# Altium schematic sheet Sheet6_Power_Path.SchDoc
size A4; SheetNumber: 6; SheetTotal: 6
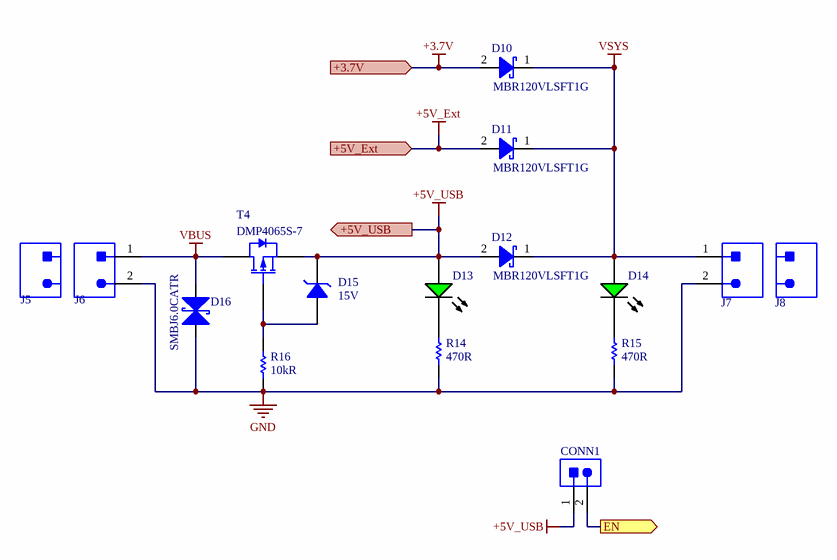
[diagram p0: Sheet6_Power_Path.SchDoc]

## Parts
?  (no value)  (graphical)
CONN1  TSW-101-07-G-D  [HDR2X1]  (value not drawn)
D10  MBR120VLSFT1G  [SOD-123F]
D11  MBR120VLSFT1G  [SOD-123F]
D12  MBR120VLSFT1G  [SOD-123F]
D13  LTST-C170GKT  [0805-LED-G]  (value not drawn)
D14  LTST-C170GKT  [0805-LED-G]  (value not drawn)
D15  Zener Voltage: 15V  [SOD-123]  (hidden comment: MMSZ5245B-TP)
D16  SMBJ6.0CATR  [DO-214AA]
J5  5447861  [5447861]  (value not drawn)
J6  5444262  [5444262]  (value not drawn)
J7  5444262  [5444262]  (value not drawn)
J8  5447861  [5447861]  (value not drawn)
R14  value 470R  [R-0805]  (hidden comment: CRGCQ0805J470R)
R15  value 470R  [R-0805]  (hidden comment: CRGCQ0805J470R)
R16  value 10kR  [R-0805]  (hidden comment: RC0805FR-0710KL)
T4  DMP4065S-7  [SOT23-3]

## Ports
+3.7V (in, see Sheet2_Hierarquia[3B], Sheet5_Proteção_Bateria[1B]), +5V_Ext (in, see Sheet2_Hierarquia[2C], Sheet3_Buck[4A], Sheet4_Carregador_Bateria[1A]), +5V_USB (out, see Sheet2_Hierarquia[2B], Sheet4_Carregador_Bateria[1B]), EN (out, see Sheet2_Hierarquia[2C], Sheet3_Buck[2B])

## Nets
+3.7V: D10.2(A) ; port +3.7V
+5V_Ext: D11.2(A) ; port +5V_Ext
+5V_USB: CONN1.1 D12.2(A) D13.2(A) D15.1(K) T4.2(S) ; port +5V_USB
GND: D16.2(Anode) J6.2 J7.2 R14.1 R15.1 R16.1
VBUS: D16.1(Cathode) J6.1 T4.3(D)
VSYS: D10.1(K) D11.1(K) D12.1(K) D14.2(A) J7.1
EN: CONN1.2 ; port EN
NetD13_1: D13.1(K) R14.2
NetD14_1: D14.1(K) R15.2
NetD15_2: D15.2(A) R16.2 T4.1(G)

## Notes on the sheet
- Título:
- Endereço:
- Rua Aprígio Veloso, 1500 - Bodocongó
  CEP: 58.429-140
  Campina Grande, Paraíba
  Brasil
- Projeto:
- Conta:
- Projetista:
- Arquivo:
- Data:
- Revisor:
- Pág.:
- Rev.:
- de

## Library data of the parts
? = Title Block
CONN1 = TSW-101-07-G-D: CONN HEADER VERT 2POS; Manufacturer: Samtec; Gender: Male; Number of Contacts: 2; Max Current Rating: 7.6A; Max Voltage Rating (AC): 550V; Supplier: Digikey; Supplier Part Number: SAM1028-01-ND; Manufacturer Part Number: TSW-101-07-G-D; RoHS: Yes; Category: Connectors; Stock: 2725; Pricing: 1=0,3, 10=0,251, 100=0,1954, 500=0,16752, 1000=0,1396, 5000=0,11965, 10000=0,11168 (USD); Mounting Technology: Through Hole; Contact Plating: Gold; Contact Material: Bronze; Contact Shape: Square; Contact Finish - Mating: GOLD; Insulation Material: PBT; Insulation Color: Black; Housing Color: Black; Housing Material: Polyester; Min Operating Temperature: -55°C; Max Operating Temperature: 125°C; Number of Rows: 2; Termination: Solder; Packaging: Bulk; Number of Positions: 2; Connector Type: Header; Series: TSW; Contact Type: Male Pin; Fastening Type: Pull; Orientation: Straight; Length: 2.54mm; Width: 5.08mm; Depth: 5.08mm; RoHS Compliant: Yes; Lead Free: Lead Free; Reach SVHC Compliant: No; Flammability Rating: UL94 V-0; ComponentLink1URL: https://datasheet.ciiva.com/6861/tsw-xxx-xx-xxx-x-xx-xxx-mkt-6861372.pdf?src-supplier=Digikey; ComponentLink1Description: https://datasheet.ciiva.com/6861/tsw-xxx-xx-xxx-x-xx-xxx-mkt-6861372.pdf?src-supplier=Digikey; ComponentLink2URL: https://datasheet.ciiva.com/48561/htsw-th-48561486.pdf?src-supplier=Avnet; ComponentLink2Description: https://datasheet.ciiva.com/48561/htsw-th-48561486.pdf?src-supplier=Avnet; Supplier 1: Digikey; Supplier Part Number 1: SAM1028-01-ND; Supplier 2: Mouser; Supplier Part Number 2: 200-TSW10107GD
D10-D12 = MBR120VLSFT1G: DIODE SCHOTTKY 20V 1A SOD123FL; Manufacturer: ON Semiconductor; Max Surge Current: 45A; Forward Voltage: 340mV; Max Reverse Current: 600uA; Element Configuration: Single; Polarity: Standard; Supplier: Digikey; Supplier Part Number: MBR120VLSFT1GOSCT-ND; Manufacturer Part Number: MBR120VLSFT1G; RoHS: Yes; Category: Schottky Diodes; Stock: 20847; Pricing: 1=0,56, 10=0,348, 100=0,2217, 500=0,16708, 1000=0,14944 (USD); Pins: 2; Min Operating Temperature: -65°C; Max Operating Temperature: 125°C; Package Quantity: 3000; Forward Current: 1A; Packaging: Tape and Reel; Max Reverse Leakage Current: 600uA; Average Rectified Current: 1A; Max Repetitive Reverse Voltage (Vrrm): 20V; Max Forward Surge Current (Ifsm): 45A; Peak Non-Repetitive Surge Current: 45A; Voltage Rating (DC): 20V; Current Rating: 1A; Output Current: 1A; Max Reverse Voltage (DC): 20V; Series: -; Length: 0.114inch; Width: 0.071inch; Height: 0.035inch; Radiation Hardening: No; Reach SVHC Compliant: No; Lead Free: Lead Free; Halogen Free: Halogen Free; RoHS Compliant: Yes; ComponentLink1URL: https://datasheet.ciiva.com/7962/85900-7962720.pdf?src-supplier=Element14; ComponentLink1Description: https://datasheet.ciiva.com/7962/85900-7962720.pdf?src-supplier=Element14; ComponentLink2URL: https://datasheet.ciiva.com/915/mbr120vlsft1-d-915659.pdf?src-supplier=Digikey; ComponentLink2Description: https://datasheet.ciiva.com/915/mbr120vlsft1-d-915659.pdf?src-supplier=Digikey; ComponentLink3URL: https://datasheet.ciiva.com/915/mbr120vlsft1-d-915660.pdf?src-supplier=Digikey; ComponentLink3Description: https://datasheet.ciiva.com/915/mbr120vlsft1-d-915660.pdf?src-supplier=Digikey; ComponentLink4URL: https://datasheet.ciiva.com/18435/70100467-18435526.pdf?src-supplier=Allied+Electronics; ComponentLink4Description: https://datasheet.ciiva.com/18435/70100467-18435526.pdf?src-supplier=Allied+Electronics; ComponentLink5URL: https://datasheet.ciiva.com/16392/mbr120vlsft1-d-16392906.pdf?src-supplier=Future+Electronics; ComponentLink5Description: https://datasheet.ciiva.com/16392/mbr120vlsft1-d-16392906.pdf?src-supplier=Future+Electronics; Supplier 1: Digikey; Supplier Part Number 1: MBR120VLSFT1GOSCT-ND; Supplier 2: Mouser; Supplier Part Number 2: 863-MBR120VLSFT1G
D13 D14 = LTST-C170GKT: LED GREEN CLEAR SMD; Manufacturer: Vishay Lite-On; Lens Color: Colorless; Luminous Intensity: 6mcd; Forward Voltage: 2.1V; Test Current: 10mA; Wavelength: 565nm; Viewing Angle: 130°; Dominant Wavelength: 569nm; Lens Style: Diffused,Colorless,Rectangular; Forward Current: 30mA; Number of LEDs: 1; Power Dissipation: 100mW; Reverse Voltage: 5V; Supplier 1: Digi-Key; Manufacturer Part Number: LTST-C170GKT; RoHS: Yes; Category: LEDs; Stock 1: 753504; Pricing 1: 1=0,30000, 10=0,16000, 100=0,07440, 500=0,06870, 1000=0,05382 (USD); Mount: Surface Mount; Case/Package: 0805; Number of Pins: 2; Color: Green; Case Code (Metric): 2012; Case Code (Imperial): 0805; Min Operating Temperature: -55°C; Max Operating Temperature: 85°C; Package Quantity: 1; Packaging: Tape and Reel; Series: CHIPLED 0805; Lens Transparency: Clear; Illumination Color: Green; Number of Elements: 1; Power Rating: 100mW; Voltage: 5V; Length: 2mm; Width: 1.25mm; Height: 1.1mm; Depth: 1.25mm; Radiation Hardening: No; RoHS Compliant: Yes; Lead Free: Lead Free; ComponentLink1URL: https://datasheet.ciiva.com/2110/ltst-c170gkt-2110128.pdf?src-supplier=Digi-Key; ComponentLink1Description: https://datasheet.ciiva.com/2110/ltst-c170gkt-2110128.pdf?src-supplier=Digi-Key; ComponentLink2URL: https://datasheet.ciiva.com/11773/0900766b80dc0278-11773630.pdf?src-supplier=RSComponents; ComponentLink2Description: https://datasheet.ciiva.com/11773/0900766b80dc0278-11773630.pdf?src-supplier=RSComponents; ComponentLink3URL: https://datasheet.ciiva.com/12400/lite-on-ltst-c170gkt-187191-12400783.pdf?src-supplier=Mouser; ComponentLink3Description: https://datasheet.ciiva.com/12400/lite-on-ltst-c170gkt-187191-12400783.pdf?src-supplier=Mouser; ComponentLink4URL: https://datasheet.ciiva.com/15117/getdatasheetpartid-142079-15117738.pdf?src-supplier=Verical; ComponentLink4Description: https://datasheet.ciiva.com/15117/getdatasheetpartid-142079-15117738.pdf?src-supplier=Verical; ComponentLink5URL: https://datasheet.ciiva.com/25772/ltst-c170gkt-25772881.pdf?src-supplier=Allied+Electronics; ComponentLink5Description: https://datasheet.ciiva.com/25772/ltst-c170gkt-25772881.pdf?src-supplier=Allied+Electronics; ComponentLink6URL: https://datasheet.ciiva.com/16387/ltst-c170gkt-16387357.pdf?src-supplier=Future+Electronics; ComponentLink6Description: https://datasheet.ciiva.com/16387/ltst-c170gkt-16387357.pdf?src-supplier=Future+Electronics; Supplier 2: Mouser; Supplier Part Number 2: 859-LTST-C170GKT; Supplier Part Number 1: 160-1179-1-ND; JLCPCB Part: C125090
D15 = MMSZ5245B-TP: DIODE ZENER 15V 500MW SOD123; Manufacturer: MCC; Tolerance: 5%; Impedance: 16R; Max Reverse Leakage Current: 100nA; Test Current: 8.5mA; Element Configuration: Single; Supplier 1: Digi-Key; Manufacturer Part Number: MMSZ5245B-TP; RoHS: Yes; Category: Zener Diodes; Stock 1: 330368; Pricing 1: 1=0,22000, 10=0,17700, 100=0,09400, 500=0,06188, 1000=0,04208 (USD); Mount: Surface Mount; Number of Pins: 2; Min Operating Temperature: -55°C; Max Operating Temperature: 150°C; Packaging: Tape and Reel; Package Quantity: 1; Max Power Dissipation: 500mW; Power Dissipation: 500mW; Voltage Tolerance: 5%; Series: -; Lead Free: Lead Free; ComponentLink1URL: https://datasheet.ciiva.com/890/mmsz5221-mmsz5259sod123-890445.pdf?src-supplier=Digi-Key; ComponentLink1Description: https://datasheet.ciiva.com/890/mmsz5221-mmsz5259sod123-890445.pdf?src-supplier=Digi-Key; ComponentLink2URL: https://datasheet.ciiva.com/890/mmsz5221-mmsz5259sod123-890446.pdf?src-supplier=Digi-Key; ComponentLink2Description: https://datasheet.ciiva.com/890/mmsz5221-mmsz5259sod123-890446.pdf?src-supplier=Digi-Key; ComponentLink3URL: https://datasheet.ciiva.com/890/mmsz5221-mmsz5259sod123-890447.pdf?src-supplier=Digi-Key; ComponentLink3Description: https://datasheet.ciiva.com/890/mmsz5221-mmsz5259sod123-890447.pdf?src-supplier=Digi-Key; Supplier 2: Mouser; Supplier 3: Arrow Electronics; Supplier Part Number 1: MMSZ5245B-TPMSCT-ND; Supplier Part Number 2: 833-MMSZ5245B-TP; Supplier Part Number 3: MMSZ5245B-TP
D16 = SMBJ6.0CA-TR: TVS DIODE 6VWM 10.3VC SMB; Manufacturer: STMicroelectronics; Reverse Standoff Voltage: 6V; Min Breakdown Voltage: 6.7V; Clamping Voltage: 13.7V; Peak Pulse Power: 600W; Peak Pulse Current: 290A; Number of Bidirectional Channels: 1; Power Line Protection: No; Test Current: 10mA; Direction: Bidirectional; Max Reverse Leakage Current: 20uA; Element Configuration: Single; Diode Type: ZENER; Capacitance: 3.85nF; Max Breakdown Voltage: 7.05V; Supplier 1: Digi-Key; Manufacturer Part Number: SMBJ6.0CA-TR; RoHS: Yes; Category: Diodes; Stock 1: 1863; Pricing 1: 1=0,44000, 10=0,35800, 100=0,24390, 500=0,18296, 1000=0,13721 (USD); Mount: Surface Mount; Case/Package: DO-214AA; Number of Pins: 2; Min Operating Temperature: -55°C; Max Operating Temperature: 150°C; Resistor Type: Zener; Packaging: Tape and Reel; Voltage Rating (DC): 6V; Series: SMBJ, TRANSIL™; Operating Supply Voltage: 6V; Reverse Breakdown Voltage: 6.7V; Package Quantity: 1; Max Surge Current: 10mA; Breakdown Voltage: 6.7V; Polarity: Bidirectional; Number of Elements: 1; Leakage Current: 20uA; Power Dissipation: 600W; Clamping Voltage-Max: 13.7V; Length: 4.6mm; Width: 3.95mm; Height: 2.45mm; Radiation Hardening: No; RoHS Compliant: Yes; Lead Free: Lead Free; REACH SVHC: No SVHC; ComponentLink1URL: https://datasheet.ciiva.com/15143/getdatasheetpartid-64868-15143186.pdf?src-supplier=Verical; ComponentLink1Description: https://datasheet.ciiva.com/15143/getdatasheetpartid-64868-15143186.pdf?src-supplier=Verical; ComponentLink2URL: https://datasheet.ciiva.com/7973/1761316-7973591.pdf?src-supplier=Element14; ComponentLink2Description: https://datasheet.ciiva.com/7973/1761316-7973591.pdf?src-supplier=Element14; ComponentLink3URL: https://datasheet.ciiva.com/337/cd00001366-337980.pdf?src-supplier=Digi-Key; ComponentLink3Description: https://datasheet.ciiva.com/337/cd00001366-337980.pdf?src-supplier=Digi-Key; ComponentLink4URL: https://datasheet.ciiva.com/337/cd00001366-337979.pdf?src-supplier=Digi-Key; ComponentLink4Description: https://datasheet.ciiva.com/337/cd00001366-337979.pdf?src-supplier=Digi-Key; ComponentLink5URL: https://datasheet.ciiva.com/337/cd00001366-337981.pdf?src-supplier=Digi-Key; ComponentLink5Description: https://datasheet.ciiva.com/337/cd00001366-337981.pdf?src-supplier=Digi-Key; ComponentLink6URL: https://datasheet.ciiva.com/7973/1761316-7973594.pdf?src-supplier=Element14; ComponentLink6Description: https://datasheet.ciiva.com/7973/1761316-7973594.pdf?src-supplier=Element14; ComponentLink7URL: https://datasheet.ciiva.com/41443/001184246-da-01-en-transil-600w-6-smbj6-0ca-tr-do-214aa-stm-41443708.pdf?src-supplier=Conrad; ComponentLink7Description: https://datasheet.ciiva.com/41443/001184246-da-01-en-transil-600w-6-smbj6-0ca-tr-do-214aa-stm-41443708.pdf?src-supplier=Conrad; Supplier 2: Mouser; Supplier 3: Arrow Electronics; Supplier Part Number 3: SMBJ6.0CA-TR; Supplier Part Number 2: 511-SMBJ6.0CA-TR; Supplier Part Number 1: 497-7454-1-ND
J5 J8 = 5447861: TERM BLOCK PLUG 2POS STR 3.81MM; Manufacturer: Phoenix Contact; Current Rating: 8A; Voltage Rating: 160V; Number of Positions: 2; Number of Levels: 1; Connector Type: Screw; Voltage: 300V; Wire Gauge (Max): 30AWG; Wire Gauge (Min): 14AWG; Pitch: 0.15inch; Supplier 1: Digi-Key; Manufacturer Part Number: 5447861; RoHS: Yes; Category: Terminal Blocks; Stock 1: 30203; Pricing 1: 1=2,56000, 10=2,45300, 50=2,38620, 100=2,23000, 250=2,05160, 500=1,89550, 1000=1,80631, 2500=1,77954 (USD); Mount: Free Hanging; Number of Pins: 2; Color: Green; Contact Plating: Tin; Housing Material: Polyamide; Package Quantity: 100; Packaging: Bulk; Number of Positions Per Level: 2; Termination: Screw; Current: 8A; Flammability Rating: UL94 V-0; ComponentLink1URL: https://datasheet.ciiva.com/29706/5447861-29706032.pdf?src-supplier=Digi-Key; ComponentLink1Description: https://datasheet.ciiva.com/29706/5447861-29706032.pdf?src-supplier=Digi-Key; Supplier 2: Mouser; Supplier Part Number 1: 277-11343-ND; Supplier Part Number 2: 651-5447861; JLCPCB Part: *
J6 J7 = 5444262: TERM BLOCK HDR 2POS 90DEG 3.81MM; Manufacturer: Phoenix Contact; Current Rating: 8A; Voltage Rating: 160V; Number of Positions: 2; Number of Levels: 1; Voltage: 300V; Pitch: 0.15inch; Supplier 1: Digi-Key; Manufacturer Part Number: 5444262; RoHS: Yes; Category: Terminal Blocks; Stock 1: 66186; Pricing 1: 1=0,87000, 10=0,83600, 50=0,81320, 100=0,76000, 250=0,69920, 500=0,64600, 1000=0,61560, 2500=0,60648 (USD); Mount: Through Hole; Contact Plating: Tin; Color: Green; Housing Material: Polyamide; Packaging: Bulk; Termination: Solder; Package Quantity: 100; Number of Positions Per Level: 2; Current: 8A; Length: 9.2mm; RoHS Compliant: Yes; Flammability Rating: UL94 V-0; ComponentLink1URL: https://datasheet.ciiva.com/29682/5444262-29682658.pdf?src-supplier=Digi-Key; ComponentLink1Description: https://datasheet.ciiva.com/29682/5444262-29682658.pdf?src-supplier=Digi-Key; Supplier 2: Mouser; Supplier Part Number 2: 651-5444262; Supplier Part Number 1: 277-11313-ND; JLCPCB Part: *
R14 R15 = CRGCQ0805J470R: RES 470 OHM 5% 1/8W 0805; Manufacturer: TE Connectivity; Max Power Dissipation: 125mW; Temperature Coefficient: 100ppm/°C; Operating Supply Voltage: 150V; Supplier: Digikey; Supplier Part Number: A130132CT-ND; Manufacturer Part Number: CRGCQ0805J470R; RoHS: Yes; Category: Chip SMD Resistors; Stock: 837845; Pricing: 1=0,1, 10=0,026, 50=0,0162, 100=0,0137, 500=0,00942, 1000=0,00813 (USD); Case/Package: 0805; Case Code (Imperial): 0805; Case Code (Metric): 2012; Min Operating Temperature: -55°C; Max Operating Temperature: 155°C; Features: Moisture Resistant,Automotive AEC-Q200; Series: CRGCQ; Packaging: Cut Tape; Tolerance: 5%; Number of Terminations: 2; Power Rating: 125mW; Voltage Rating: 150V; Voltage Rating (DC): 150V; Height: 650um; Ratings: AEC-Q200; RoHS Compliant: Yes; ComponentLink1URL: http://datasheet.octopart.com/CRGCQ0805J470R-TE-Connectivity-datasheet-114679081.pdf?src-supplier=Digikey; ComponentLink1Description: http://datasheet.octopart.com/CRGCQ0805J470R-TE-Connectivity-datasheet-114679081.pdf?src-supplier=Digikey; ComponentLink2URL: http://datasheet.octopart.com/CRGCQ0805J470R-TE-Connectivity-datasheet-114679081.pdf?src-supplier=Farnell; ComponentLink2Description: http://datasheet.octopart.com/CRGCQ0805J470R-TE-Connectivity-datasheet-114679081.pdf?src-supplier=Farnell; ComponentLink3URL: http://datasheet.octopart.com/CRGCQ0805J470R-TE-Connectivity-datasheet-114679081.pdf?src-supplier=Avnet; ComponentLink3Description: http://datasheet.octopart.com/CRGCQ0805J470R-TE-Connectivity-datasheet-114679081.pdf?src-supplier=Avnet; ComponentLink4URL: http://datasheet.octopart.com/CRGCQ0805J470R-TE-Connectivity-datasheet-114679081.pdf?src-supplier=Mouser; ComponentLink4Description: http://datasheet.octopart.com/CRGCQ0805J470R-TE-Connectivity-datasheet-114679081.pdf?src-supplier=Mouser; ComponentLink5URL: http://datasheet.octopart.com/CRGCQ0805J470R-TE-Connectivity-datasheet-114679081.pdf?src-supplier=Newark; ComponentLink5Description: http://datasheet.octopart.com/CRGCQ0805J470R-TE-Connectivity-datasheet-114679081.pdf?src-supplier=Newark; ComponentLink6URL: http://datasheet.octopart.com/CRGCQ0805J470R-TE-Connectivity-datasheet-114679081.pdf?src-supplier=Onlinecomponents.com; ComponentLink6Description: http://datasheet.octopart.com/CRGCQ0805J470R-TE-Connectivity-datasheet-114679081.pdf?src-supplier=Onlinecomponents.com; ComponentLink7URL: https://datasheet.octopart.com/CRGCQ0805J470R-TE-Connectivity-datasheet-114679081.pdf?src-supplier=Master+Electronics; ComponentLink7Description: https://datasheet.octopart.com/CRGCQ0805J470R-TE-Connectivity-datasheet-114679081.pdf?src-supplier=Master+Electronics; ComponentLink8URL: http://datasheet.octopart.com/CRGCQ0805J470R-TE-Connectivity-datasheet-114679081.pdf?src-supplier=Heilind+Electronics; ComponentLink8Description: http://datasheet.octopart.com/CRGCQ0805J470R-TE-Connectivity-datasheet-114679081.pdf?src-supplier=Heilind+Electronics; ComponentLink9URL: http://datasheet.octopart.com/CRGCQ0805J470R-TE-Connectivity-datasheet-114679081.pdf?src-supplier=Sager+Electronics; ComponentLink9Description: http://datasheet.octopart.com/CRGCQ0805J470R-TE-Connectivity-datasheet-114679081.pdf?src-supplier=Sager+Electronics; ComponentLink10URL: http://datasheet.octopart.com/CRGCQ0805J470R-TE-Connectivity-datasheet-114679081.pdf?src-supplier=Interstate+Connecting+Components; ComponentLink10Description: http://datasheet.octopart.com/CRGCQ0805J470R-TE-Connectivity-datasheet-114679081.pdf?src-supplier=Interstate+Connecting+Components; ComponentLink11URL: http://datasheet.octopart.com/CRGCQ0805J470R-TE-Connectivity-datasheet-114679081.pdf?src-supplier=Electro+Sonic; ComponentLink11Description: http://datasheet.octopart.com/CRGCQ0805J470R-TE-Connectivity-datasheet-114679081.pdf?src-supplier=Electro+Sonic; Supplier 1: Mouser; Supplier Part Number 1: 279-CRGCQ0805J470R; Supplier 2: Digikey; Supplier Part Number 2: A130132CT-ND
R16 = RC0805FR-0710KL: RES 10K OHM 1% 1/8W 0805; Manufacturer: Yageo; Voltage Rating: 150V; Power Rating: 125mW; Temperature Coefficient: 100ppm/°C; Supplier: Digikey; Supplier Part Number: 311-10.0KCRCT-ND; Manufacturer Part Number: RC0805FR-0710KL; RoHS: Yes; Category: Chip SMD Resistors; Stock: 2107948; Pricing: 1=0,1, 10=0,027, 50=0,017, 100=0,0142, 500=0,00976, 1000=0,00844 (USD); Case/Package: 0805; Case Code (Imperial): 0805; Case Code (Metric): 2012; Min Operating Temperature: -55°C; Max Operating Temperature: 155°C; Packaging: Tape and Reel; Package Quantity: 1; Termination: SMD/SMT; Series: RC; Tolerance: 1%; Resistor Type: Thick Film; Number of Terminations: 2; Max Power Dissipation: 125mW; Features: Moisture Resistant; Construction: Rectangular; Resistance Tolerance: 1%; Technology: THICK FILM; Voltage Rating (AC): 150V; Length: 0.079inch; Width: 0.049inch; Height: 0.024inch; Depth: 1.25mm; RoHS Compliant: Yes; Reach SVHC Compliant: Unknown; Military Standard: Not; Lead Free: Lead Free; Supplier 1: Digikey; Supplier Part Number 1: 311-10.0KCRCT-ND; Supplier 2: Mouser; Supplier Part Number 2: 603-RC0805FR-0710KL; Supplier 3: Digikey; Supplier Part Number 3: 541-3976-1-ND
T4 = DMP4065S-7: MOSFET P-CH 40V 2.4A SOT23; Manufacturer: Diodes; Number of Channels: 1; Rds On Max: 80mR; Input Capacitance: 587pF; Max Power Dissipation: 720mW; Drain to Source Breakdown Voltage: -40V; Drain to Source Resistance: 64mR; Gate to Source Voltage (Vgs): 20V; Turn-Off Delay Time: 36.3ns; Turn-On Delay Time: 3.6ns; Supplier: Digikey; Supplier Part Number: DMP4065S-7DICT-ND; Manufacturer Part Number: DMP4065S-7; RoHS: Yes; Category: MOSFETs; Stock: 25010; Pricing: 1=0,43, 10=0,302, 100=0,1523, 500=0,135, 1000=0,10506 (USD); Mounting Technology: Surface Mount; Case/Package: SOT-23; Pins: 3; Min Operating Temperature: -55°C; Max Operating Temperature: 150°C; Packaging: Cut Tape; Series: -; Drain to Source Voltage (Vdss): 40V; Continuous Drain Current (ID): 2.4A; Power Dissipation: 720mW; Height: 1.1mm; RoHS Compliant: Yes; ComponentLink1URL: http://www.farnell.com/datasheets/2649034.pdf?src-supplier=Farnell; ComponentLink1Description: http://www.farnell.com/datasheets/2649034.pdf?src-supplier=Farnell; ComponentLink2URL: http://www.mouser.com/ds/2/115/DMP4065S-537770.pdf?src-supplier=Mouser; ComponentLink2Description: http://www.mouser.com/ds/2/115/DMP4065S-537770.pdf?src-supplier=Mouser; ComponentLink3URL: https://www.diodes.com/assets/Datasheets/DMP4065S.pdf?src-supplier=Digikey; ComponentLink3Description: https://www.diodes.com/assets/Datasheets/DMP4065S.pdf?src-supplier=Digikey; ComponentLink4URL: http://diodes.com/datasheets/DMP4065S.pdf?src-supplier=Avnet; ComponentLink4Description: http://diodes.com/datasheets/DMP4065S.pdf?src-supplier=Avnet; ComponentLink5URL: http://www.farnell.com/datasheets/2649034.pdf?src-supplier=Newark; ComponentLink5Description: http://www.farnell.com/datasheets/2649034.pdf?src-supplier=Newark; ComponentLink6URL: http://www.farnell.com/datasheets/2649034.pdf?src-supplier=Element14; ComponentLink6Description: http://www.farnell.com/datasheets/2649034.pdf?src-supplier=Element14; ComponentLink7URL: https://datasheet.octopart.com/DMP4065S-7-Diodes-Inc.-datasheet-129886328.pdf?src-supplier=TME; ComponentLink7Description: https://datasheet.octopart.com/DMP4065S-7-Diodes-Inc.-datasheet-129886328.pdf?src-supplier=TME; Supplier 1: Digikey; Supplier Part Number 1: DMP4065S-7DICT-ND; Supplier 2: Mouser; Supplier Part Number 2: 621-DMP4065S-7